# EAGLE design HA DC Motor Controller V1.1 (EAGLE 6.1)
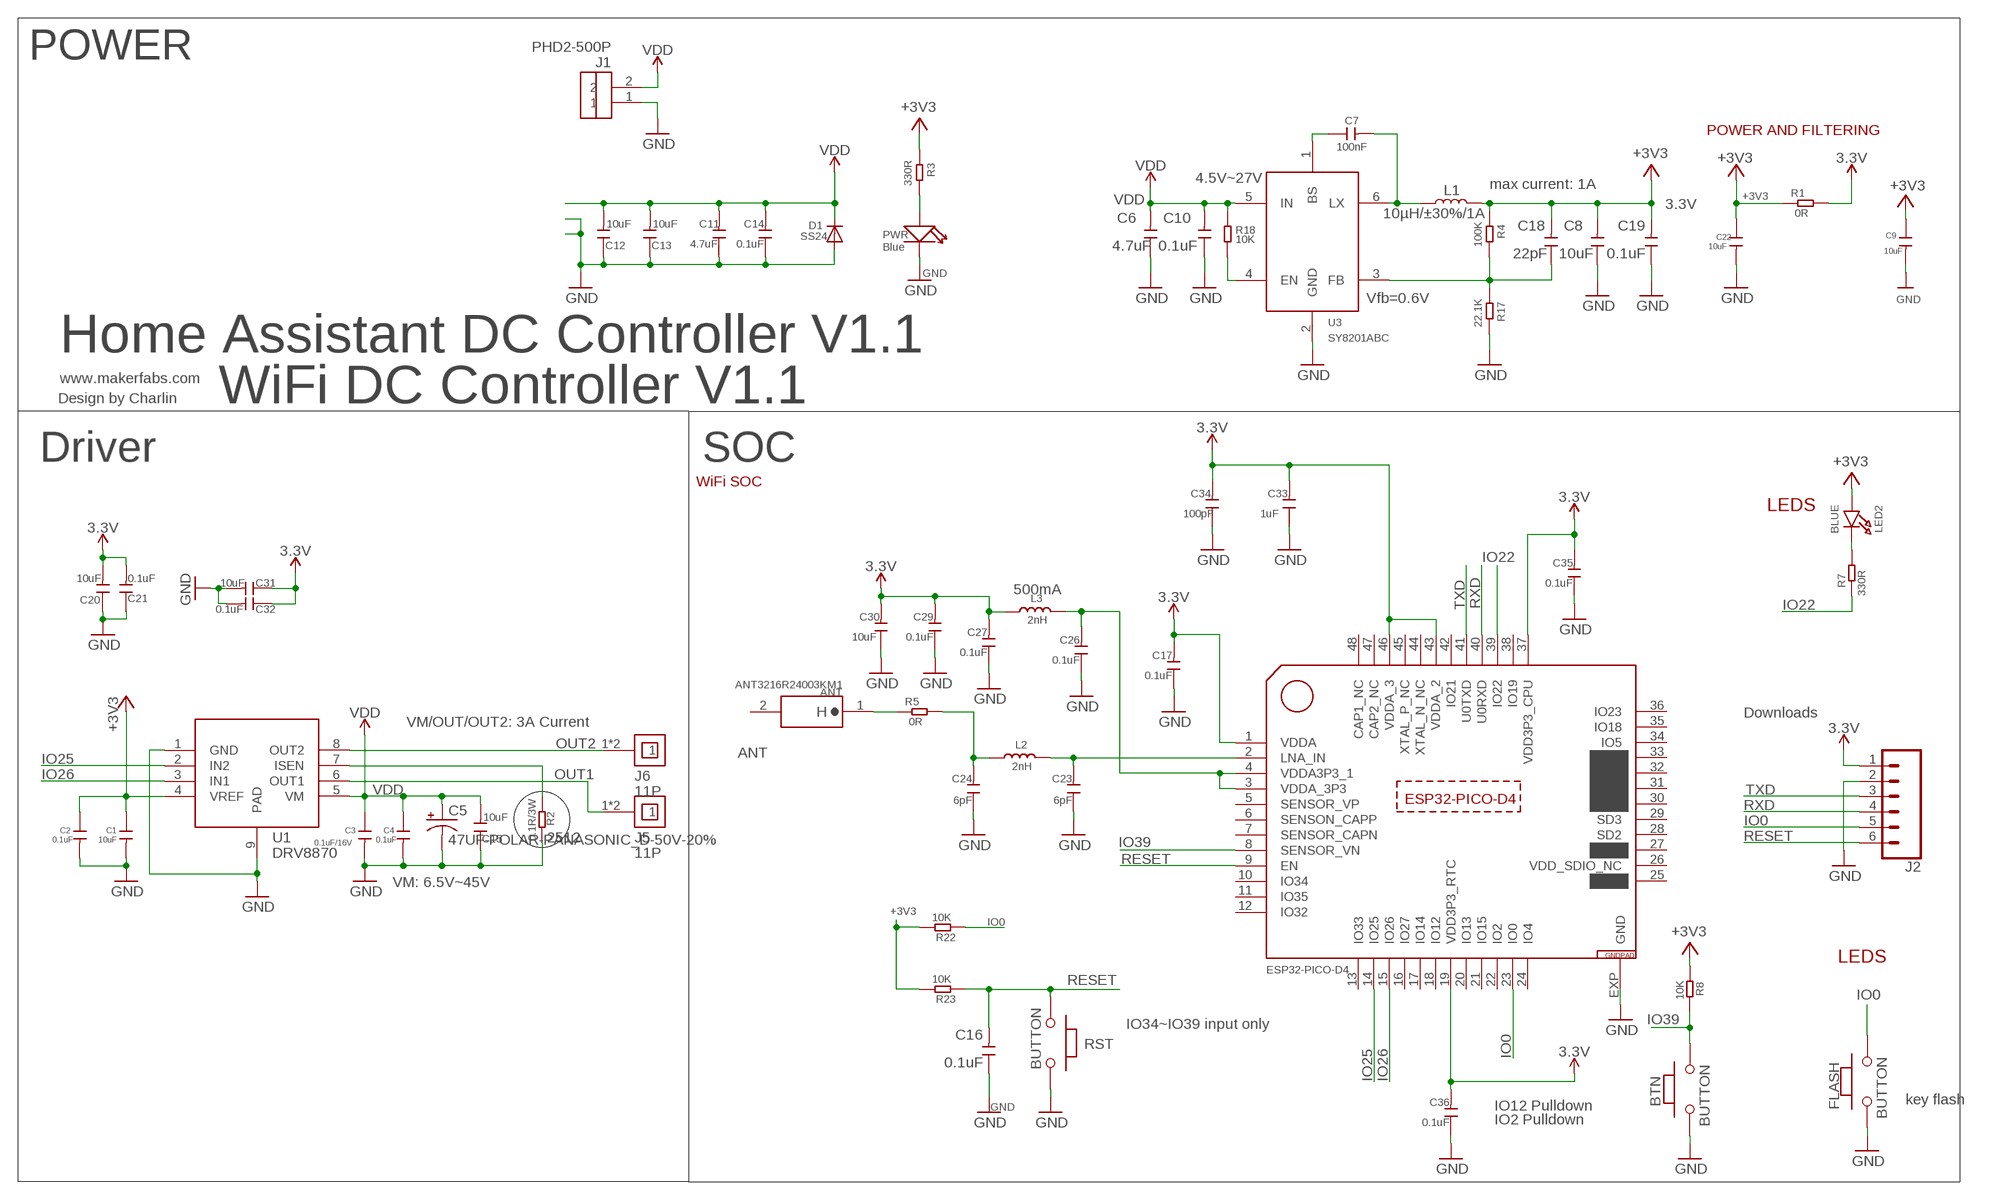
[diagram p0: schematic, sheet 1]

## Parts
ANT  ANT3216R24003KM1  [ANT-1206]
BTN  BUTTON  PB157  [157SW]
C1  10uF  C-0603  [0603]
C2  0.1uF  C-0603  [0603]
C3  0.1uF/16V  C-0603  [0603]
C4  0.1uF  C-0603  [0603]
C5  47UF-POLAR-PANASONIC_D-50V-20%  [PANASONIC_D]
C6  4.7uF  C-0603  [0603]
C7  100nF  C-0603  [0603]
C8  10uF  C-0603  [0603]
C9  10uF  C-0603  [0603]
C10  0.1uF  C-0603  [0603]
C11  4.7uF  C-0603  [0603]
C12  10uF  DISCRETE_C-1206  [DISCRETE_C1206]
C13  10uF  DISCRETE_C-1206  [DISCRETE_C1206]
C14  0.1uF  C-0603  [0603]
C15  10uF  DISCRETE_C-1206  [DISCRETE_C1206]
C16  0.1uF  C-0603  [0603]
C17  0.1uF  C-0603  [0603]
C18  22pF  C-0603  [0603]
C19  0.1uF  C-0603  [0603]
C20  10uF  DISCRETE_C-0603  [DISCRETE_C0603]
C21  0.1uF  DISCRETE_C-0603  [DISCRETE_C0603]
C22  10uF  C-0603  [0603]
C23  6pF  C-0603  [0603]
C24  6pF  C-0603  [0603]
C26  0.1uF  C-0603  [0603]
C27  0.1uF  C-0603  [0603]
C29  0.1uF  C-0603  [0603]
C30  10uF  C-0603  [0603]
C31  10uF  DISCRETE_C-0603  [DISCRETE_C0603]
C32  0.1uF  DISCRETE_C-0603  [DISCRETE_C0603]
C33  1uF  C-0603  [0603]
C34  100pF  C-0603  [0603]
C35  0.1uF  C-0603  [0603]
C36  0.1uF  C-0603  [0603]
D1  SS24  DIODESMA  [SMADIODE]
FLASH  BUTTON  PB157  [157SW]
J1  PHD2-500P  [OPL_EAGLE_LIBRARY_2P-5.0]
J2  CONN_06SILK_FEMALE_PTH  [1X06]
J5  11P  [1*1P-4*1MM]
J6  11P  [1*1P-4*1MM]
L1  10µH/±30%/1A  INDUCTOR-CR54-47UH  [CR54]
L2  2nH  DISCRETE_L0603  [DISCRETE_L0603]
L3  2nH  DISCRETE_L0603  [DISCRETE_L0603]
LED2  BLUE  LED0805_NOOUTLINE  [CHIPLED_0805_NOOUTLINE]
PWR  Blue  LED'0603'  [LED-0603]
R1  0R  R-0603  [R0603]
R2  0.1R/3W  DISCRETE_R-2512  [DISCRETE_R2512]
R3  330R  R-0603  [R0603]
R4  100K  R-0603  [R0603]
R5  0R  R-0603  [R0603]
R7  330R  R-0603  [R0603]
R8  10K  R-0603  [R0603]
R17  22.1K  R-0603  [R0603]
R18  10K  R-0603  [R0603]
R22  10K  R-0603  [R0603]
R23  10K  R-0603  [R0603]
RST  BUTTON  PB157  [157SW]
U1  DRV8870  [SOP-8-EP]
U3  SY8201ABC  [SOT-23-6]
U$2  ESP32-PICO-D4  [QFN48]

## Nets
3.3V: C17.2 C20.2 C21.2 C27.2 C29.2 C30.2 C31.1 C32.1 C33.2 C34.2 C35.2 C36.2 J2.1 L3.1 R1.2 U$2.1(VDDA) U$2.19(VDD3P3_RTC) U$2.37(VDD3P3_CPU) U$2.43(VDDA_2) U$2.46(VDDA_3)
+3V3: C1.1 C2.1 C8.2 C9.1 C18.2 C19.2 C22.1 L1.P$2 LED2.A R1.1 R3.1 R4.1 R8.1 R22.2 R23.2 U1.4(VREF)
GND: BTN.1 C1.2 C2.2 C3.2 C4.2 C5.- C6.1 C8.1 C9.2 C10.1 C11.1 C12.1 C13.1 C14.1 C15.1 C16.1 C17.1 C19.1 C20.1 C21.1 C22.2 C23.1 C24.1 C26.1 C27.1 C29.1 C30.1 C31.2 C32.2 C33.1 C34.1 C35.1 C36.1 D1.A FLASH.1 J1.1 J2.2 PWR.- R2.1 R17.2 RST.1 U1.1(GND) U1.9(PAD) U3.2(GND) U$2.EXP(GND)
IO0: FLASH.2 J2.5 R22.1 U$2.23(IO0)
IO22: R7.1 U$2.39(IO22)
IO25: U1.2(IN2) U$2.14(IO25)
IO26: U1.3(IN1) U$2.15(IO26)
IO39: BTN.2 R8.2 U$2.8(SENSOR_VN)
N$1: PWR.+ R3.2
N$4: C7.2 L1.P$1 U3.6(LX)
N$5: C7.1 U3.1(BS)
N$8: R2.2 U1.7(ISEN)
N$9: C18.1 R4.2 R17.1 U3.3(FB)
N$12: R18.2 U3.4(EN)
N$13: C26.2 L3.2 U$2.3(VDDA_3P3) U$2.4(VDDA3P3_1)
N$14: C23.2 L2.2 U$2.2(LNA_IN)
N$15: C24.2 L2.1 R5.2
N$17: ANT.1 R5.1
N$27: LED2.C R7.2
OUT1: J5.1 J5.1@1 U1.6(OUT1)
OUT2: J6.1 J6.1@1 U1.8(OUT2)
RESET: C16.2 J2.6 R23.1 RST.2 U$2.9(EN)
RXD: J2.4 U$2.40(U0RXD)
TXD: J2.3 U$2.41(U0TXD)
VDD: C3.1 C4.1 C5.+ C6.2 C10.2 C11.2 C12.2 C13.2 C14.2 C15.2 D1.C J1.2 R18.1 U1.5(VM) U3.5(IN)
Unconnected: ANT.2 U$2.5(SENSOR_VP) U$2.6(SENSON_CAPP) U$2.7(SENSOR_CAPN) U$2.10(IO34) U$2.11(IO35) U$2.12(IO32) U$2.13(IO33) U$2.16(IO27) U$2.17(IO14) U$2.18(IO12) U$2.20(IO13) U$2.21(IO15) U$2.22(IO2) U$2.24(IO4) U$2.25(IO16) U$2.27(IO17) U$2.28(SD2) U$2.29(SD3) U$2.30(CMD) U$2.31(CLK) U$2.32(SD0) U$2.33(SD1) U$2.34(IO5) U$2.35(IO18) U$2.36(IO23) U$2.38(IO19) U$2.42(IO21) U$2.44(XTAL_N_NC) U$2.45(XTAL_P_NC) U$2.47(CAP2_NC) U$2.48(CAP1_NC)

## Notes on the sheet
- POWER
- POWER AND FILTERING
- 4.5V~27V
- max current: 1A
- 3.3V
- Vfb=0.6V
- Home Assistant DC Controller V1.1
- www.makerfabs.com
- Design by Charlin | WiFi DC Controller V1.1
- Driver | SOC
- WiFi SOC
- LEDS
- 500mA
- Downloads
- VM/OUT/OUT2: 3A Current
- ANT
- 2512
- VM: 6.5V~45V
- LEDS
- IO34~IO39 input only
- key flash
- IO12 Pulldown
- IO2 Pulldown

## Power pins joined to a net without a drawn wire
VDD_SDIO_NC: U$2.26(VDD_SDIO_NC)

## Library data of the parts
ANT = sale:ANT3216R24003KM1
BTN FLASH RST = MySMD:PB157
C1-C4 C6-C11 C14 C16-C19 C22-C24 C26 C27 C29 C30 C33-C36 = Discrete:C*: Ceramic Capacitors
C5 = SparkFun-Capacitors:47UF-POLAR: 47µF polarized capacitors A capacitor is a passive two-terminal electrical component used to store electrical energy temporarily in an electric field.
C12 C13 C15 C20 C21 C31 C32 = A9G:DISCRETE_C*: Ceramic Capacitors
D1 = adafruit:DIODE: Diode SMADIODE - SMA Surface Mount Package 20V 1A Schottky Diode Digikey: 641-1014-6-ND DO-1N4148 - Through Hole Small Current Diode SOD-123 20V 1 A (.5mV Vf) Schottky Diode - Digikey: MBRX120TPMSCT-ND SOD-323 10V 570mA (.38mV Vf, 3ns) Schottky Diode - Digikey: ZLLS410CT-ND SOD-523 30V 30mA Schottky Diode (RB751S-40TE61) - Digikey: RB751S-40TE61CT-ND SOT23-R/W - SOT23 Package (R = Solder Paste/Reflow Ovens, W = Hand-Soldering) BAT54Film 40V 300mA - Digikey: 497-7162-1-ND
J1 = COM-ZYPDN-SO:*PHD2-500P*
J2 = SparkFun-Connectors:CONN_06: Multi connection point. Often used as Generic Header-pin footprint for 0.1 inch spaced/style header connections On any of the 0.1 inch spaced packages, you can populate with these: Break Away Headers - Straight <https://www.sparkfun.com/products/116> (PRT-00116) Break Away Male Headers - Right Angle <https://www.sparkfun.com/products/553> (PRT-00553) Female Headers <https://www.sparkfun.com/products/115> (PRT-00115) Break Away Headers - Machine Pin <https://www.sparkfun.com/products/117> (PRT-00117) Break Away Female Headers - Swiss Machine Pin <https://www.sparkfun.com/products/743> (PRT-00743) Arduino Stackable Header - 6 Pin <https://www.sparkfun.com/products/9280> (PRT-09280) For SCREWTERMINALS and SPRING TERMINALS visit here: Screw Terimnals on SparkFun.com <https://www.sparkfun.com/search/results?term=Screw+Terminals> (5mm/3.5mm/2.54mm spacing) This device is also useful as a general connection point to wire up your design to another part of your project. Our various solder wires solder well into these plated through hole pads. Hook-Up Wire - Assortment (Stranded, 22 AWG) <https://www.sparkfun.com/products/11375> (PRT-11375) Hook-Up Wire - Assortment (Solid Core, 22 AWG) <https://www.sparkfun.com/products/11367> (PRT-11367) View the entire wire category on our website here <https://www.sparkfun.com/categories/141>; PROD_ID: CONN-08437
J5 J6 = sale:1*1P
L1 = SparkFun-Coils:INDUCTOR: Inductors Resist changes in electrical current. Basically a coil of wire. SparkFun Products: SparkFun Load Cell Amplifier - HX711 <https://www.sparkfun.com/products/13879> IOIO-OTG - V2.2 <https://www.sparkfun.com/products/13613>; PROD_ID: NDUC-10789; VALUE: 47µH/±30%/750mA
L2 L3 = A9G:DISCRETE_L*
LED2 = microbuilder:LED: LED 0603 - 0603 Surface Mount Package 2mA: Green LED - Low Power (3.9mcd, 2ma, 1.7Vf) - Digikey: 475-2709-2-ND Orange LED - Low Power (9.8mcd, 2ma, 1.8Vf) - Digikey: 475-1194-2-ND Red LED - Low Power (5mcd, 2ma, 1.8Vf) - Digikey: 475-1195-2-ND Yellow LED - Low Power (7mcd, 2ma, 1.8Vf) - Digikey: 475-1196-2-ND 5mA: Blue LED - Low Power (17mcd, 5ma, 2.9Vf) - Digikey: LNJ937W8CRACT-ND 0805 - 0805 Surface Mount Package 2mA: Red LED (8.8mcd, 2mA, 1.8Vf, Clear) - Low Power [Digikey: 475-2510-1-ND] Green LED (5mcd, 2mA, 1.8Vf, Clear) - Low Power [Digikey: 475-2730-1-ND] Yellow LED (11.3mcd, 2mA, 1.8Vf, Clear) - Low Power [Digikey: 475-2555-1-ND] 20mA: Red LED (104mcd, 20mA, Diffused) - LS R976 [Digikey: 475-1278-6-ND] Red LED (12mcd, 20mA, 2.0Vf, Clear) - APT2012EC [Digikey: 754-1128-1-ND] Green LED (15mcd, 20mA, 2.2Vf, Clear) - APT2012GC [Digikey: 754-1131-1-ND] Orange LED (160mcd, 20mA, 2.1Vf, Clear) - APT2012SECK [Digikey: 754-1130-1-ND] 1206 - 1206 Surface Mount Package Green LED (26mcd, 20mA, Diffused) - LG N971 [Digikey: 475-1407-6-ND] Red LED (15mcd, 20mA, Diffused) - LH N974 [Digikey: 475-1416-6-ND] Cree - Cree High-Power Surface Mount LEDs XPEBWT-L1-0000-00D50 - White 111lm 350mA 2.9Vf 6200K 110° XTEAWT-00-0000-00000LEE3 - White 114lm 350mA 2.85Vf 5000K 115° Everlight - Everlight 45-21 Series Surface Mount LEDs 45-21/QK2C-B2832AC2CB2/2T - Warm White 2000mcd 20mA 3.25Vf 3050K 120° 45-21/LK2C-B38452C4CB2/2T - Nuetral White 2000mcd 20mA 3.25Vf 4150K 120° 45-21/LK2C-B50634C6CB2/2T - Cold White 2200mcd 20mA 3.25Vf 5650K 120° PLCC2 Reverse Mount LS T77K-J1L2-1-0-2-R18-Z - Red 11.25mcd 2mA 1.8Vf 630nm 120° LO T77K-L1M2-24-Z - Orange 19.6mcd 2mA 1.8Vf 606nm 120° LY T77K-K2M1-26-Z - Yellow 15.7mcd 2mA 1.8Vf 587nm 120°
PWR = Discrete:LED*
R1 R3-R5 R7 R8 R17 R18 R22 R23 = Discrete:R*
R2 = A9G:DISCRETE_R*
U1 = sale:DRV8870
U3 = self:SY8201ABC
U$2 = ESP32-PICO-D4:ESP32-PICO-D4

## Net classes
0 default: width 0.203 mm, drill 0.305 mm, clearance 0.152 mm
1 vbat: width 0.254 mm, drill 0.305 mm, clearance 0.152 mm

## Board
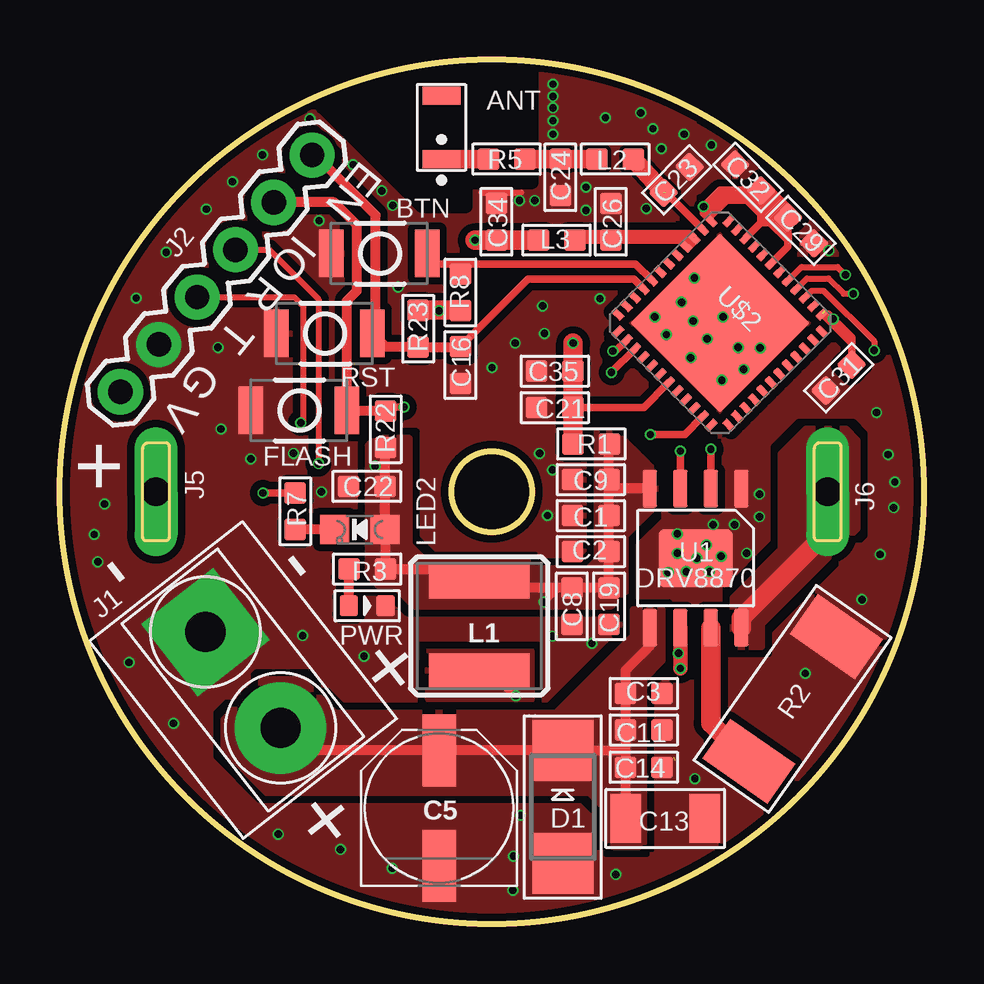
[diagram p1: board, top side]
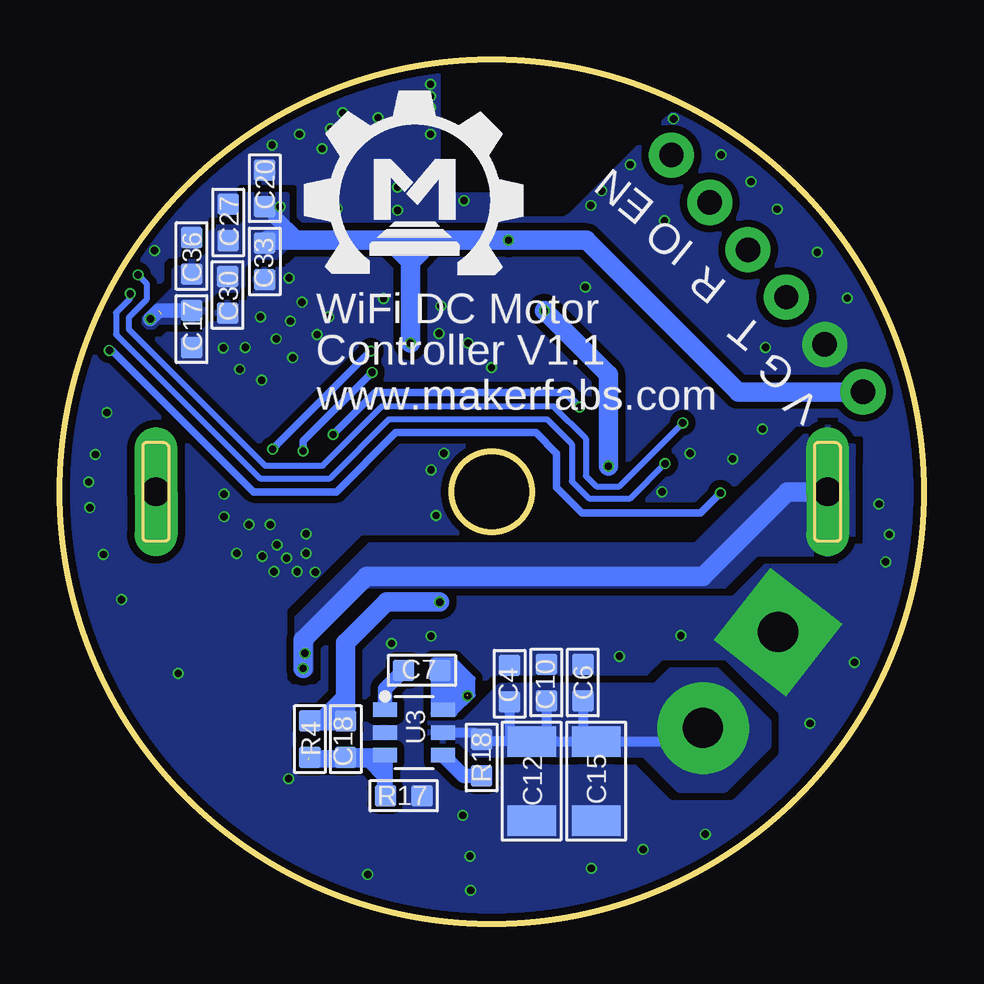
[diagram p2: board, bottom side, seen from below]

Size 36 x 36 mm. Coordinates in mm from the lower left corner, seen from the top.
Outline: circle at 18,18 radius 18
Outline: circle at 18,18 radius 1.68
Copper layers (1*16): Top 0.035mm / dielectric 1.5mm / Bottom 0.035mm
Design rules: minimum track width 6mil, minimum drill 10mil, track to track 6mil, track to pad 6mil, pad to pad 6mil, via to via 6mil, smd to smd 0mil, copper to edge 10mil, drill to drill 10mil, minimum pad ring 3mil, minimum via ring 3mil, stop-mask expansion 2mil, vias tented up to drill 100mil, thermal gap 0mil
tRestrict: area 11,29.9 to 19.7,36.1
bRestrict: area 11,29.9 to 19.7,36.2

### Footprints (pad centres in the part's own frame; a part is rotated, then mirrored left to right if it is on the bottom)
ANT-1206 = smd 0.75 x 1.6: 1 -1.325,0; 2 1.325,0
157SW = smd 1.016 x 1.981: 1 0,0; 2 4,0
0603 = smd 0.889 x 0.889: 1 -0.762,0; 2 0.762,0
PANASONIC_D = smd 3 x 1.4: + 2.4,0; - -2.4,0
DISCRETE_C1206 = smd 1.27 x 2.032: 1 -1.651,0; 2 1.651,0
DISCRETE_C0603 = smd 0.889 x 0.889: 1 -0.762,0; 2 0.762,0
SMADIODE = smd 2.54 x 2.54: A 2.349,0; C -2.349,0
OPL_EAGLE_LIBRARY_2P-5.0 = drill 1.668 pad 3.81 square: 1 -2.54,0 | drill 1.668 pad 3.81: 2 2.54,0
1X06 = drill 1.016 pad 1.88: 1 0,0; 2 2.54,0; 3 5.08,0; 4 7.62,0; 5 10.16,0; 6 12.7,0
1*1P-4*1MM = drill 1.2 offset: 1 0,0; 1@1 0,0
CR54 = smd 4.2 x 1.4: P$1 0,1.85; P$2 0,-1.85
DISCRETE_L0603 = smd 0.889 x 0.889: 1 -0.762,0; 2 0.762,0
CHIPLED_0805_NOOUTLINE = smd 1.2 x 1.2: A 0,-1.05; C 0,1.05
LED-0603 = smd 0.762 x 0.889: + -0.762,0; - 0.762,0
R0603 = smd 0.889 x 0.889: 1 -0.762,0; 2 0.762,0
DISCRETE_R2512 = smd 2.032 x 3.302: 1 -3.175,0; 2 3.175,0
SOP-8-EP = smd 1.55 x 0.6: 1 -2.9,1.905; 2 -2.9,0.635; 3 -2.9,-0.635; 4 -2.9,-1.905; 5 2.9,-1.905; 6 2.9,-0.635; 7 2.9,0.635; 8 2.9,1.905 | smd 2.4 x 3.1: 9 0,0
SOT-23-6 = smd 1 x 0.6: 1 -1.2,0.95; 2 -1.2,0; 3 -1.2,-0.95; 4 1.2,-0.95; 5 1.2,0; 6 1.2,0.95
QFN48 = smd 0.55 x 0.3: 1 -3.275,2.75; 2 -3.275,2.25; 3 -3.275,1.75; 4 -3.275,1.25; 5 -3.275,0.75; 6 -3.275,0.25; 7 -3.275,-0.25; 8 -3.275,-0.75; 9 -3.275,-1.25; 10 -3.275,-1.75; 11 -3.275,-2.25; 12 -3.275,-2.75; 25 3.275,-2.75; 26 3.275,-2.25; 27 3.275,-1.75; 28 3.275,-1.25; 29 3.275,-0.75; 30 3.275,-0.25; 31 3.275,0.25; 32 3.275,0.75; 33 3.275,1.25; 34 3.275,1.75; 35 3.275,2.25; 36 3.275,2.75 | smd 0.3 x 0.55: 13 -2.75,-3.275; 14 -2.25,-3.275; 15 -1.75,-3.275; 16 -1.25,-3.275; 17 -0.75,-3.275; 18 -0.25,-3.275; 19 0.25,-3.275; 20 0.75,-3.275; 21 1.25,-3.275; 22 1.75,-3.275; 23 2.25,-3.275; 24 2.75,-3.275; 37 2.75,3.275; 38 2.25,3.275; 39 1.75,3.275; 40 1.25,3.275; 41 0.75,3.275; 42 0.25,3.275; 43 -0.25,3.275; 44 -0.75,3.275; 45 -1.25,3.275; 46 -1.75,3.275; 47 -2.25,3.275; 48 -2.75,3.275 | smd 5.309 x 5.309: EXP 0,0

### Placement (x,y rotation side)
ANT  15.91,33.19 90 top
BTN  11.31,27.93 0 top
C1  22.13,17.01 180 top
C2  22.13,15.51 180 top
C3  24.34,9.59 0 top
C4  17.25,10 90 bottom
C5  15.8,4.82 90 top
C6  14.2,10.05 270 bottom
C7  20.91,10.56 0 bottom
C8  21.34,13.22 90 top
C9  22.13,18.51 180 top
C10  15.73,10.05 270 bottom
C11  24.34,8.07 180 top
C12  16.34,5.93 90 bottom
C13  25.23,4.38 180 top
C14  24.34,6.52 180 top
C15  13.65,5.93 90 bottom
C16  16.69,23.28 90 top
C17  30.51,24.78 90 bottom
C18  24.08,7.69 90 bottom
C19  22.89,13.22 90 top
C20  27.47,30.65 270 bottom
C21  20.63,21.51 0 top
C22  12.79,18.22 180 top
C23  25.71,31 225 top
C24  20.86,31.11 90 top
C26  22.97,29.25 270 top
C27  28.99,29.23 270 bottom
C29  30.89,28.9 135 top
C30  29.01,26.2 90 bottom
C31  32.47,22.76 225 top
C32  28.69,31.11 135 top
C33  27.46,27.6 90 bottom
C34  18.19,29.25 270 top
C35  20.63,23.03 0 top
C36  30.51,27.83 270 bottom
D1  20.96,4.87 270 top
FLASH  7.96,21.39 0 top
J1  PHD2-500P*  [OPL_EAGLE_LIBRARY_2P-5.0]  7.63,10.15 308 top
J2  2.52,22.16 51 top
J5  4,18 90 top
J6  32,18 90 top
L1  17.48,12.41 180 top
L2  23.14,31.87 0 top
L3  20.71,28.49 0 top
LED2  12.5,16.42 90 top
PWR  12.81,13.25 0 top
R1  22.15,20 180 top
R2  30.54,9.36 235 top
R3  12.81,14.77 180 top
R4  25.58,7.69 270 bottom
R5  18.62,31.87 0 top
R7  9.81,17.19 270 top
R8  16.69,26.3 90 top
R17  21.67,5.32 0 bottom
R18  18.42,6.92 270 bottom
R22  13.58,20.6 270 top
R23  14.93,24.8 90 top
RST  9.03,24.6 0 top
U1  26.5,15.23 270 top
U3  21.24,7.97 0 bottom
U$1  [MAKERFABS_0.3]  25.34,27.09 0 bottom
U$2  27.51,25.04 315 top

### Tracks (layer width: path | path; a pad name or v marks a point on that pad's centre or on a via)
3.3V  (via drill 0.3)  (1 unrouted)
  Top 0.254: 31.78,25.39 33.01,24.16 C31.1 | U$2.1 27.01,29.43 27.01,29.71
  Top 0.305: U$2.19 24.34,21.51 C21.2 | U$2.37 32.03,25.41 33.01,24.43 C31.1 | U$2.1 26.83,29.61 v26.83,29.89 27.51,30.57 C32.1 29.85,29.94 | 29.85,29.94 C29.2 30.35,28.23 U$2.43 | U$2.46 29.85,29.85 29.85,29.94 | 27.06,29.43 27.79,30.17 28.63,30.17 29.22,29.58 29.22,29.23 29.6,29.23 30.36,28.46 30.36,28.74 28.78,30.32 27.61,30.32 | 27.61,30.32 27.01,29.71 | 27.61,30.32 27.67,30.37 29.09,30.37 30.21,29.25 30.56,29.61 30.56,29.63 29.39,30.8 29.27,30.8
  Top 0.406: C31.1
  Top 0.813: L3.1 v17.3,28.49 C34.2 | R1.2 21.39,21.5 C21.2 C35.2 v21.39,24.2
  Bottom 0.254: 21.39,28.46 19.18,28.46 v17.3,28.49 | 27.03,29.45 26.83,29.66 v26.83,29.89
  Bottom 0.305: C20.2 v26.83,29.89
  Bottom 0.61: C17.2 31.89,25.54 v32.23,25.2 | 25.74,28.57 26.14,28.57 27.03,29.45
  Bottom 0.813: J2.1 7.73,22.16 14.05,28.49 v17.3,28.49 20.5,28.49 | 20.5,28.49 21.42,28.49 | 21.42,28.49 22.28,28.49 | 22.28,28.49 27.34,28.49 C33.2 | v21.39,24.2 21.39,27.6 | 21.39,27.6 21.39,28.46 21.42,28.49 | 20.5,28.49 21.39,27.6 | 21.39,27.6 22.28,28.49
  pour Bottom: 26.57,30.34 26.57,28.24 26.98,27.83 28,27.83 28.43,27.4 28.43,26.58 28.56,26.46 29.5,26.46 30,25.95 30,25.34 30.23,25.11 31.93,25.11 32.14,24.91 32.31,24.91 32.44,25.04 32.44,25.21 31.2,26.46 31.2,27.19 30.84,27.55 30.13,27.55 29.72,27.96 29.72,28.72 29.44,29 28.45,29 28.15,29.3 28.15,30.29 28.15,30.34
+3V3  (via drill 0.3)
  Top 0.254: v15.8,25.54 R8.1
  Top 0.305: C8.2 20.76,13.99 v20.17,13.4
  Top 0.406: 22.89,17.95 C1.1 C2.1 C19.2 C8.2 17.76,13.99 L1.P$2 16.97,14.77 R3.1 13.57,16.41 LED2.A C22.1 13.55,19.81 R22.2 | 22.89,17.95 C9.1 22.89,19.98 R1.1 | U1.4 23.07,18.13 22.89,17.95
  Top 0.813: R8.1 16.67,25.56 R23.2
  Bottom 0.61: 24.11,9.57 24.11,9.54 25.2,8.45 R4.1
  Bottom 0.813: R4.1 C18.2 24.09,11.7 22.38,13.4 v20.17,13.4 | v15.8,25.54 13.14,22.88 v13.14,19.07
  pour Top: 22.36,20.46 22.36,15.15 22,14.8 19.79,14.8 19.51,15.08 15.3,15.08 14.59,15.79 14.59,20.23 13.14,20.23 12.83,19.93 12.83,14.49 13.24,14.09 13.9,14.09 14.76,13.22 22.99,13.22 23.6,13.83 23.6,16.17 24.85,17.41 24.85,18.84 23.22,20.46
GND  (via drill 0.3)
  Top 0.254: 17.56,30.47 19.23,30.47
  other vias: 20.55,32.91 24.72,33.14 25.08,32.3 24.21,33.8 19.16,30.14 13.85,2.3 13.87,29.94 22.74,33.59 1.43,16.22 21.93,29.73 20.55,34 24.44,29.81 10.8,29.3 6.58,24.02 12.68,11.14 20.33,17.01 34.8,18.41 6.71,20.62 18.98,24.2 22.51,26.05 27.59,22.65 26.29,23.59 25.28,24.55 25.91,25.9 26.45,26.91 27.64,25.29 26.98,24.37 29.19,23.99 28.5,23.1 28.28,24.02 26.4,25.11 24.8,25.29 33.43,13.5 25.35,14.65 26.12,14.67 25.74,15.43 25.74,16.25 26.95,15.79 27.08,14.67 26.55,15.23 27.56,15.31 28.12,16.63 29.16,16.96 28.63,15.43 27.23,16.63 29.16,17.9 34.04,21.3 34.52,19.55 34.75,17.34 34.19,15.38 31.07,10.43 26.47,6.04 23.17,2.05 18.88,1.39 18.9,2.81 19.21,4.51 11.69,3.09 9.1,3.72 10.11,12 22.18,11.67 20.53,11.98 20,19.6 1.58,15.08 18.01,23.18 20.12,25.75 6.1,29.78 4.43,27.98 3.18,26.08 8.44,32.05 2.88,10.89 1.86,17.49 21.93,30.7 20.55,34.99 20.55,33.47 26.02,32.91 7.96,19.37 9.73,19.6 20.53,18.91 14.1,26.53 4.73,8.35 10.42,33.54 12.22,31.64 13.42,30.55 32.06,28.06 27.16,32.45 20.55,34.48 7.19,30.93 19.79,30.14 10.9,18 20.2,24.6
  pour Top (isolate 0.305, rank 6): -1,39 -1.23,-1.03 41,-1.2 41,39
  pour Bottom (isolate 0.305, rank 6): -4,-1 41,-1 41,39 -4,39
  pour Top (isolate 0.152): 9.48,39.06 9.48,34.69 14.74,29.43 26.04,29.43 26.42,29.81 26.42,39.06
IO0  (via drill 0.3)
  Top 0.305: U$2.23 26.05,20.39 v24.62,20.39 | R22.1 13.75,21.53 v14.34,21.53
  Top 0.406: R22.1 13.55,21.39 FLASH.2 11.96,25.97 12.38,26.38 12.38,29.12 11.44,30.06 J2.5
  Bottom 0.305: v24.62,20.39 22.87,22.14 14.95,22.14 v14.34,21.53
IO22  (via drill 0.3)
  Top 0.254: U$2.39 31.34,26.38 31.83,26.38 33.94,24.27 v33.94,23.89
  Top 0.305: R7.1 v8.46,17.95
  Bottom 0.305: v8.46,17.95 9.1,17.31 9.15,17.26 9.3,17.11 14.23,17.11 15.3,18.18 15.3,19.6 16.16,20.46 22,20.46 24.47,18 27.92,18 33.81,23.89 v33.94,23.89
IO25  (via drill 0.3)
  Top 0.305: U$2.14 23.16,23.87 v23.04,23.87 | U1.2 v27.13,19.78
  Bottom 0.305: v23.04,23.87 v27.13,19.78
IO26  (via drill 0.3)
  Top 0.305: U1.3 v25.86,19.7 | U$2.15 v22.99,22.99 v22.99,22.98
  Bottom 0.305: v22.99,22.98 25.86,20.11 v25.86,19.7
IO39
  Top 0.305: U$2.8 23.99,27.5 16.57,27.5 | R8.2 16.69,27.37 16.57,27.5 | 16.57,27.5 15.74,27.5 BTN.2
N$1
  Top 0.406: PWR.+ R3.2
N$4  (via drill 0.3)  (1 unrouted)
  Top 0.406: L1.P$1 17.93,10.56 v19.01,9.49
  Bottom 0.254: 20.4,8.75 19.56,8.75 18.8,9.52 18.8,10.2 19.56,10.96 20.43,10.96 20.43,8.75 20.25,8.93 20.25,10.18 19.69,10.73 19.61,10.73 19.01,10.12 19.01,9.54 19.51,9.03 19.69,9.03 19.77,9.11 19.77,10.38 19.64,10.51 19.64,9.34 19.51,9.21 19.51,9.41 19.18,9.74 19.18,10.1 19.51,10.43 19.51,9.59 19.36,9.74 19.36,10.05
  Bottom 0.406: U3.6 20.04,9.49 | 20.04,9.49 20.04,10.45 C7.2 | v19.01,9.49 20.04,9.49
  pour Top: 15.35,11.34 19.67,11.34 19.67,9.34 15.35,9.34
N$5
  Bottom 0.61: U3.1 22.44,9.79 C7.1
N$8
  Top 0.813: U1.7 27.13,8.35 R2.2
N$9  (1 unrouted)
  Bottom 0.61: R17.1 U3.3 23.99,7.02 C18.1 R4.2 | 22.48,5.53 22.48,6.16 23.12,6.8 25.66,6.8
N$12
  Bottom 0.61: R18.2 19.19,6.16 U3.4
N$13  (1 unrouted)
  Top 0.305: U$2.3 U$2.4 25.83,28.49 | 25.83,28.49 C26.2 L3.2 | 25.83,28.49 26.5,28.49 26.24,28.23 26.24,28.57 | 26.24,28.57 26.34,28.67 | 26.24,28.57 26.09,28.41 | 21.49,28.59 26.42,28.59 26.24,28.77 21.29,28.77
N$14  (1 unrouted)
  Top 0.305: 23.91,31.86 L2.2 | U$2.2 25.23,30.5
  Top 0.762: C23.2 L2.2
N$15
  Top 0.762: R5.2 C24.2 L2.1
N$17
  Top 0.305: ANT.1
  Top 0.762: ANT.1 R5.1
N$27
  Top 0.406: LED2.C R7.2
OUT1  (via drill 0.3)
  Top 0.61: U1.6 v25.86,10.63
  Bottom 0.813: J5.1 5.67,18 9.2,14.47 23.22,14.47 25.86,11.83 v25.86,10.63
  other vias: 25.79,11.27
  pour Bottom: 2.95,19.52 2.95,19.9 3.71,20.67 4.6,20.67 9.51,15.76 23.07,15.76 26.09,12.74 26.09,10.51 25.99,10.4 25.68,10.4 25.56,10.53 25.56,11.6 25.56,11.8 23.27,14.09 8.31,14.09 6.97,15.43 3.74,15.43 2.98,16.2 2.98,19.55
OUT2
  Top 0.813: U1.8 28.4,12.74 32,16.34 J6.1
  pour Top: 28.07,11.55 28.07,13.58 30.08,15.59 30.08,19.57 31.1,20.59 32.77,20.59 33.23,20.13 33.23,16.48 29.24,12.49 29.24,11.65 29.24,11.55
RESET
  Top 0.305: U$2.9 23.92,26.86 19.51,26.86 C16.2
  Top 0.406: C16.2 R23.1 13.58,24.04 RST.2 13.16,24.73 13.16,29.53 10.66,32.03 J2.6
RXD  (via drill 0.3)
  Top 0.254: U$2.40 31.14,26.89 32.03,26.89 32.67,26.25 v33.08,26.25 | J2.4 8.71,28.09 10.78,26.03 v10.78,19.17
  Bottom 0.254: v33.08,26.25 33.08,26.05 33.66,25.47 33.66,24.55 27.67,18.56 24.75,18.56 22.28,21.02 15.7,21.02 14.66,19.98 14.66,18.43 13.95,17.72 12.22,17.72 v10.78,19.17
TXD  (via drill 0.3)
  Top 0.254: U$2.41 30.91,27.37 32.42,27.37 v32.75,27.04 | J2.3 9.77,26.11 10.14,25.75 10.14,20.97 v10.04,20.87
  Bottom 0.254: v32.75,27.04 32.39,26.69 32.39,26 33.13,25.26 33.13,24.78 27.44,19.09 25.05,19.09 22.59,21.55 15.42,21.55 14.08,20.21 14.08,18.66 13.64,18.23 12.68,18.23 v10.04,20.87
VDD
  Top 0.406: U1.5 24.59,11.57 23.58,10.56 C3.1 C11.2 23.58,7.2 | 23.58,7.2 C14.2 C13.2 | 23.58,7.2 23.56,7.22 D1.C C5.+ | C5.+ | C5.+ 10.12,7.22 J1.2
  Bottom 0.406: U3.5 18.7,7.97 R18.1 18.32,7.59 17.3,7.59 | 17.3,7.59 C12.2 15.35,7.59 | 15.35,7.59 C15.2 | C4.1 17.25,7.64 17.3,7.59 | C10.2 15.73,7.97 15.35,7.59 | C6.2 14.2,8.14 C15.2 | C15.2 9.75,7.59 J1.2
  pour Top: 23.91,13.07 23.91,11.98 20.68,8.75 11.46,8.75 10.06,10.15 8.49,10.15 6.84,8.5 6.84,7.26 8.62,5.48 22.08,5.48 22.76,4.79 22.76,3.52 23.07,3.22 24.16,3.22 24.31,3.37 24.31,10.18 25.1,10.96 25.1,13.07
  pour Bottom: 20.58,7.64 19.34,7.64 18.75,7.05 11.66,7.05 10.19,5.58 8.29,5.58 6.46,7.41 6.46,8.4 8.62,10.56 10.55,10.56 11.21,9.9 17.66,9.9 19.18,8.37 20.58,8.37

### Text on the board
tPlace: EN | IO | R | T | G | V | + | - | - | + | +
bPlace: EN | IO | R | T | WiFi DC Motor | G | Controller V1.1 | V | www.makerfabs.com